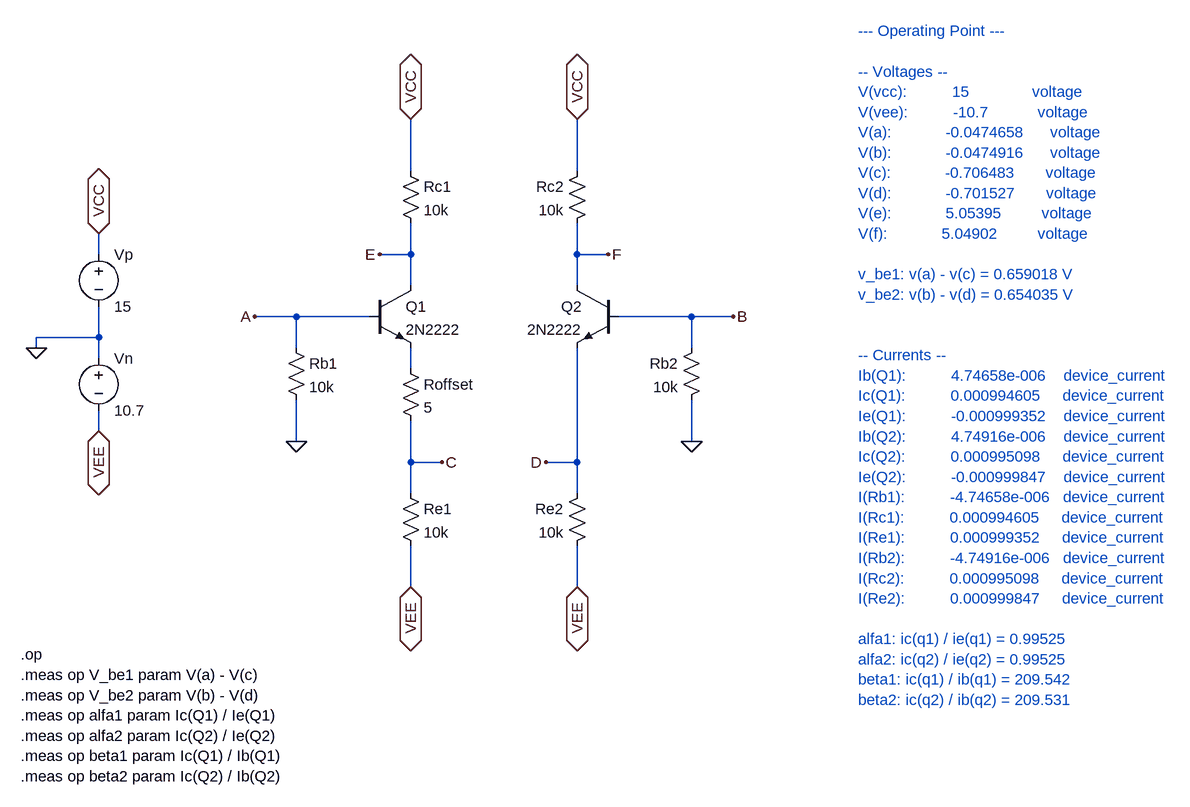
[diagram p0: schematic e1_1_a.asc]
e1_1_a.asc, the LTspice schematic file:
Version 4
SHEET 1 1744 944
WIRE 528 16 528 -64
WIRE 784 16 784 -64
WIRE 48 144 48 112
WIRE 528 144 528 96
WIRE 528 144 480 144
WIRE 784 144 784 96
WIRE 832 144 784 144
WIRE 528 192 528 144
WIRE 784 192 784 144
WIRE 352 240 288 240
WIRE 464 240 352 240
WIRE 960 240 848 240
WIRE 1024 240 960 240
WIRE 48 272 48 224
WIRE 48 272 -48 272
WIRE -48 288 -48 272
WIRE 352 288 352 240
WIRE 960 288 960 240
WIRE 48 304 48 272
WIRE 528 320 528 288
WIRE 48 416 48 384
WIRE 352 432 352 368
WIRE 960 432 960 368
WIRE 528 464 528 400
WIRE 576 464 528 464
WIRE 784 464 784 288
WIRE 784 464 736 464
WIRE 528 512 528 464
WIRE 784 512 784 464
WIRE 528 656 528 592
WIRE 784 656 784 592
FLAG -48 288 0
FLAG 48 112 VCC
IOPIN 48 112 BiDir
FLAG 48 416 VEE
IOPIN 48 416 BiDir
FLAG 352 432 0
FLAG 528 -64 VCC
IOPIN 528 -64 BiDir
FLAG 480 144 E
FLAG 288 240 A
FLAG 528 656 VEE
IOPIN 528 656 BiDir
FLAG 576 464 C
FLAG 960 432 0
FLAG 784 -64 VCC
IOPIN 784 -64 BiDir
FLAG 832 144 F
FLAG 1024 240 B
FLAG 784 656 VEE
IOPIN 784 656 BiDir
FLAG 736 464 D
SYMBOL voltage 48 128 R0
SYMATTR InstName Vp
SYMATTR Value 15
SYMBOL voltage 48 288 R0
SYMATTR InstName Vn
SYMATTR Value 10.7
SYMBOL npn 464 192 R0
SYMATTR InstName Q1
SYMATTR Value 2N2222
SYMBOL res 512 304 R0
SYMATTR InstName Roffset
SYMATTR Value 5
SYMBOL res 512 0 R0
SYMATTR InstName Rc1
SYMATTR Value 10k
SYMBOL res 336 272 R0
SYMATTR InstName Rb1
SYMATTR Value 10k
SYMBOL res 512 496 R0
SYMATTR InstName Re1
SYMATTR Value 10k
SYMBOL npn 848 192 M0
SYMATTR InstName Q2
SYMATTR Value 2N2222
SYMBOL res 800 0 M0
SYMATTR InstName Rc2
SYMATTR Value 10k
SYMBOL res 976 272 M0
SYMATTR InstName Rb2
SYMATTR Value 10k
SYMBOL res 800 496 M0
SYMATTR InstName Re2
SYMATTR Value 10k
TEXT -72 760 Left 2 !.op\n.meas op V_be1 param V(a) - V(c)\n.meas op V_be2 param V(b) - V(d)\n.meas op alfa1 param Ic(Q1) / Ie(Q1)\n.meas op alfa2 param Ic(Q2) / Ie(Q2)\n.meas op beta1 param Ic(Q1) / Ib(Q1)\n.meas op beta2 param Ic(Q2) / Ib(Q2)
TEXT 1216 -200 Left 2 ;--- Operating Point ---\n \n-- Voltages --\nV(vcc):          15              voltage\nV(vee):          -10.7           voltage\nV(a):            -0.0474658      voltage\nV(b):            -0.0474916      voltage\nV(c):            -0.706483       voltage\nV(d):            -0.701527       voltage\nV(e):            5.05395         voltage\nV(f):            5.04902         voltage\n \nv_be1: v(a) - v(c) = 0.659018 V\nv_be2: v(b) - v(d) = 0.654035 V\n \n \n-- Currents --\nIb(Q1):          4.74658e-006    device_current\nIc(Q1):          0.000994605     device_current\nIe(Q1):          -0.000999352    device_current\nIb(Q2):          4.74916e-006    device_current\nIc(Q2):          0.000995098     device_current\nIe(Q2):          -0.000999847    device_current\nI(Rb1):          -4.74658e-006   device_current\nI(Rc1):          0.000994605     device_current\nI(Re1):          0.000999352     device_current\nI(Rb2):          -4.74916e-006   device_current\nI(Rc2):          0.000995098     device_current\nI(Re2):          0.000999847     device_current\n \nalfa1: ic(q1) / ie(q1) = 0.99525\nalfa2: ic(q2) / ie(q2) = 0.99525\nbeta1: ic(q1) / ib(q1) = 209.542\nbeta2: ic(q2) / ib(q2) = 209.531

The netlist it stands for:
* e1_1_a.asc
Vp VCC 0 15
Vn 0 VEE 10.7
Q1 E A N001 0 2N2222
Roffset N001 C 5
Rc1 VCC E 10k
Rb1 A 0 10k
Re1 C VEE 10k
Q2 F B D 0 2N2222
Rc2 VCC F 10k
Rb2 B 0 10k
Re2 D VEE 10k
.model NPN NPN
.model PNP PNP
.lib standard.bjt
.op
.meas op V_be1 param V(a) - V(c)
.meas op V_be2 param V(b) - V(d)
.meas op alfa1 param Ic(Q1) / Ie(Q1)
.meas op alfa2 param Ic(Q2) / Ie(Q2)
.meas op beta1 param Ic(Q1) / Ib(Q1)
.meas op beta2 param Ic(Q2) / Ib(Q2)
* --- Operating Point ---
* -- Voltages --
* V(vcc):          15              voltage
* V(vee):          -10.7           voltage
* V(a):            -0.0474658      voltage
* V(b):            -0.0474916      voltage
* V(c):            -0.706483       voltage
* V(d):            -0.701527       voltage
* V(e):            5.05395         voltage
* V(f):            5.04902         voltage
* v_be1: v(a) - v(c) = 0.659018 V
* v_be2: v(b) - v(d) = 0.654035 V
* -- Currents --
* Ib(Q1):          4.74658e-006    device_current
* Ic(Q1):          0.000994605     device_current
* Ie(Q1):          -0.000999352    device_current
* Ib(Q2):          4.74916e-006    device_current
* Ic(Q2):          0.000995098     device_current
* Ie(Q2):          -0.000999847    device_current
* I(Rb1):          -4.74658e-006   device_current
* I(Rc1):          0.000994605     device_current
* I(Re1):          0.000999352     device_current
* I(Rb2):          -4.74916e-006   device_current
* I(Rc2):          0.000995098     device_current
* I(Re2):          0.000999847     device_current
* alfa1: ic(q1) / ie(q1) = 0.99525
* alfa2: ic(q2) / ie(q2) = 0.99525
* beta1: ic(q1) / ib(q1) = 209.542
* beta2: ic(q2) / ib(q2) = 209.531
.backanno
.end